# EAGLE design espJhon (EAGLE 9.6.2)
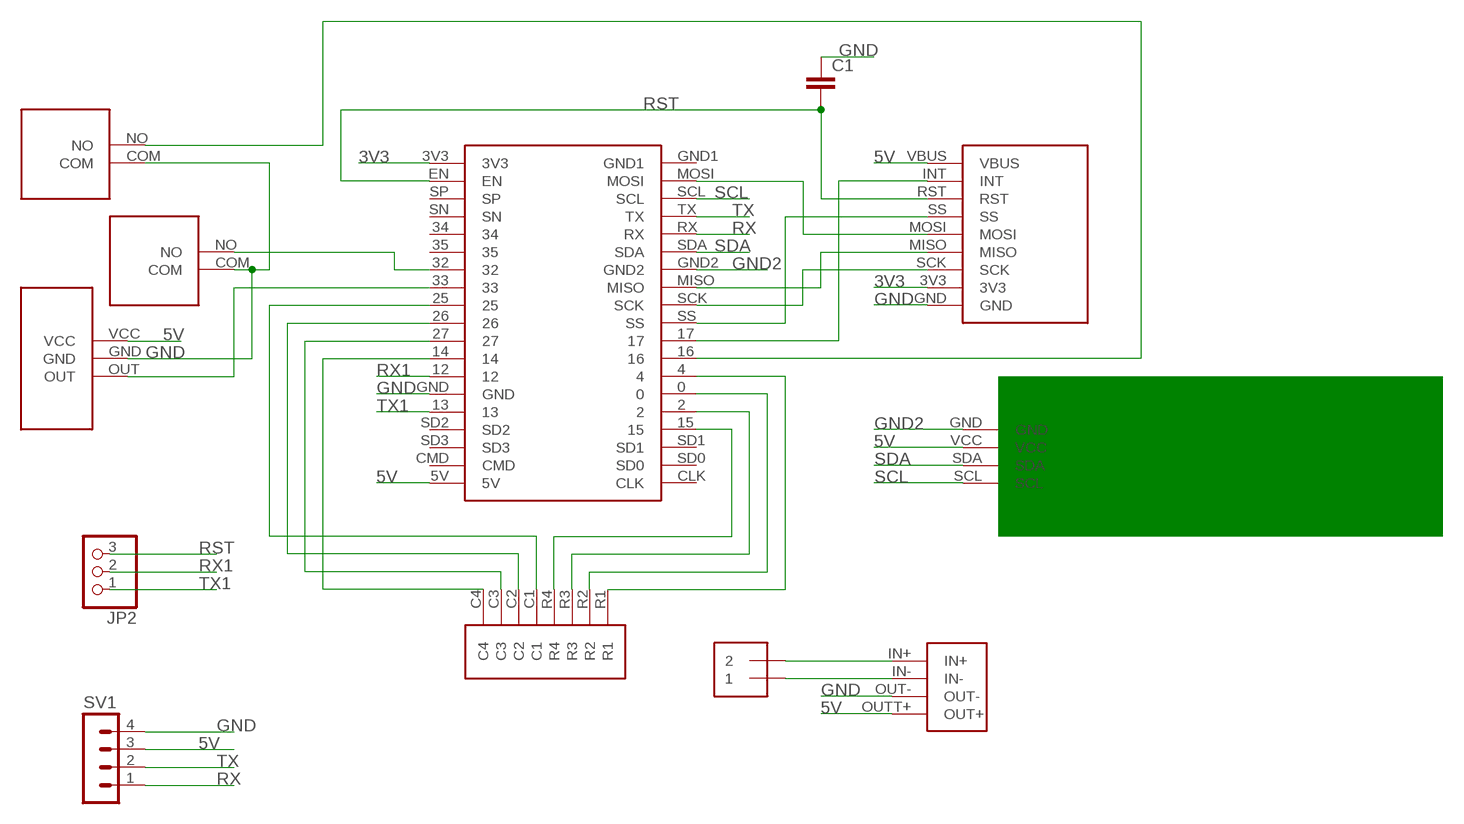
[diagram p0: schematic, sheet 1]

## Parts
C1  C2.5/6  [C2.5-6]
J1  1X2-3.5MM  [1X2-3.5MM]
JP2  PINHD-1X3  [1X03]
SV1  MA04-1  [MA04-1]
U$1  XL4005E1  [XL4005E1]
U$2  USB_HOST  [USB_HOST]
U$3  ESP32_NEW  [ESP32_NEW]
U$4  KEYPAD_4X4  [KEYPAD_4X4]
U$6  LCD_I2C  [LCD_I2C]
U$7  IR_SENSOR  [IR_SENSOR]
U$8  SWITCHLIMITER  [SWICHLIMITER]
U$9  SWITCHLIMITER  [SWICHLIMITER]

## Nets
3V3: U$2.3V3 U$3.3V3
5V: SV1.3 U$1.OUTT+(OUT+) U$2.VBUS U$3.5V U$6.VCC U$7.VCC
GND: C1.1 SV1.4 U$1.OUT- U$2.GND U$3.GND U$7.GND U$8.COM U$9.COM
GND2: U$3.GND2 U$6.GND
N$1: J1.2 U$1.IN+
N$2: J1.1 U$1.IN-
N$3: U$3.14 U$4.C4
N$4: U$3.27 U$4.C3
N$5: U$3.26 U$4.C2
N$6: U$3.25 U$4.C1
N$7: U$3.15 U$4.R4
N$8: U$3.2 U$4.R3
N$9: U$3.0 U$4.R2
N$10: U$3.4 U$4.R1
N$11: U$2.MOSI U$3.MOSI
N$12: U$2.MISO U$3.MISO
N$13: U$2.SCK U$3.SCK
N$14: U$2.SS U$3.SS
N$16: U$2.INT U$3.17
N$20: U$3.33 U$7.OUT
N$21: U$3.32 U$9.NO
N$22: U$3.16 U$8.NO
RST: C1.2 JP2.3 U$2.RST U$3.EN
RX: SV1.1 U$3.RX
RX1: JP2.2 U$3.12
SCL: U$3.SCL U$6.SCL
SDA: U$3.SDA U$6.SDA
TX: SV1.2 U$3.TX
TX1: JP2.1 U$3.13
Unconnected: U$3.34 U$3.35 U$3.CLK U$3.CMD U$3.GND1 U$3.SD0 U$3.SD1 U$3.SD2 U$3.SD3 U$3.SN U$3.SP

## Library data of the parts
C1 = capacitor-wima:C: CAPACITOR naming: grid - package width
J1 = adafruit:1X2: 3.5mm Terminal block http://www.ladyada.net/library/pcb/eaglelibrary.html
JP2 = adafruit:PINHD-1X3: PIN HEADER
SV1 = con-lstb:MA04-1: PIN HEADER; OC_FARNELL: unknown; OC_NEWARK: unknown
U$1 = FusionLocal v17:XL4005E1
U$2 = FusionLocal v17:USB_HOST
U$3 = FusionLocal v17:ESP32_NEW
U$4 = FusionLocal v17:KEYPAD_4X4
U$6 = LocalLib:LCD_I2C
U$7 = LocalLib:IR_SENSOR
U$8 U$9 = LocalLib:SWITCHLIMITER

## Board
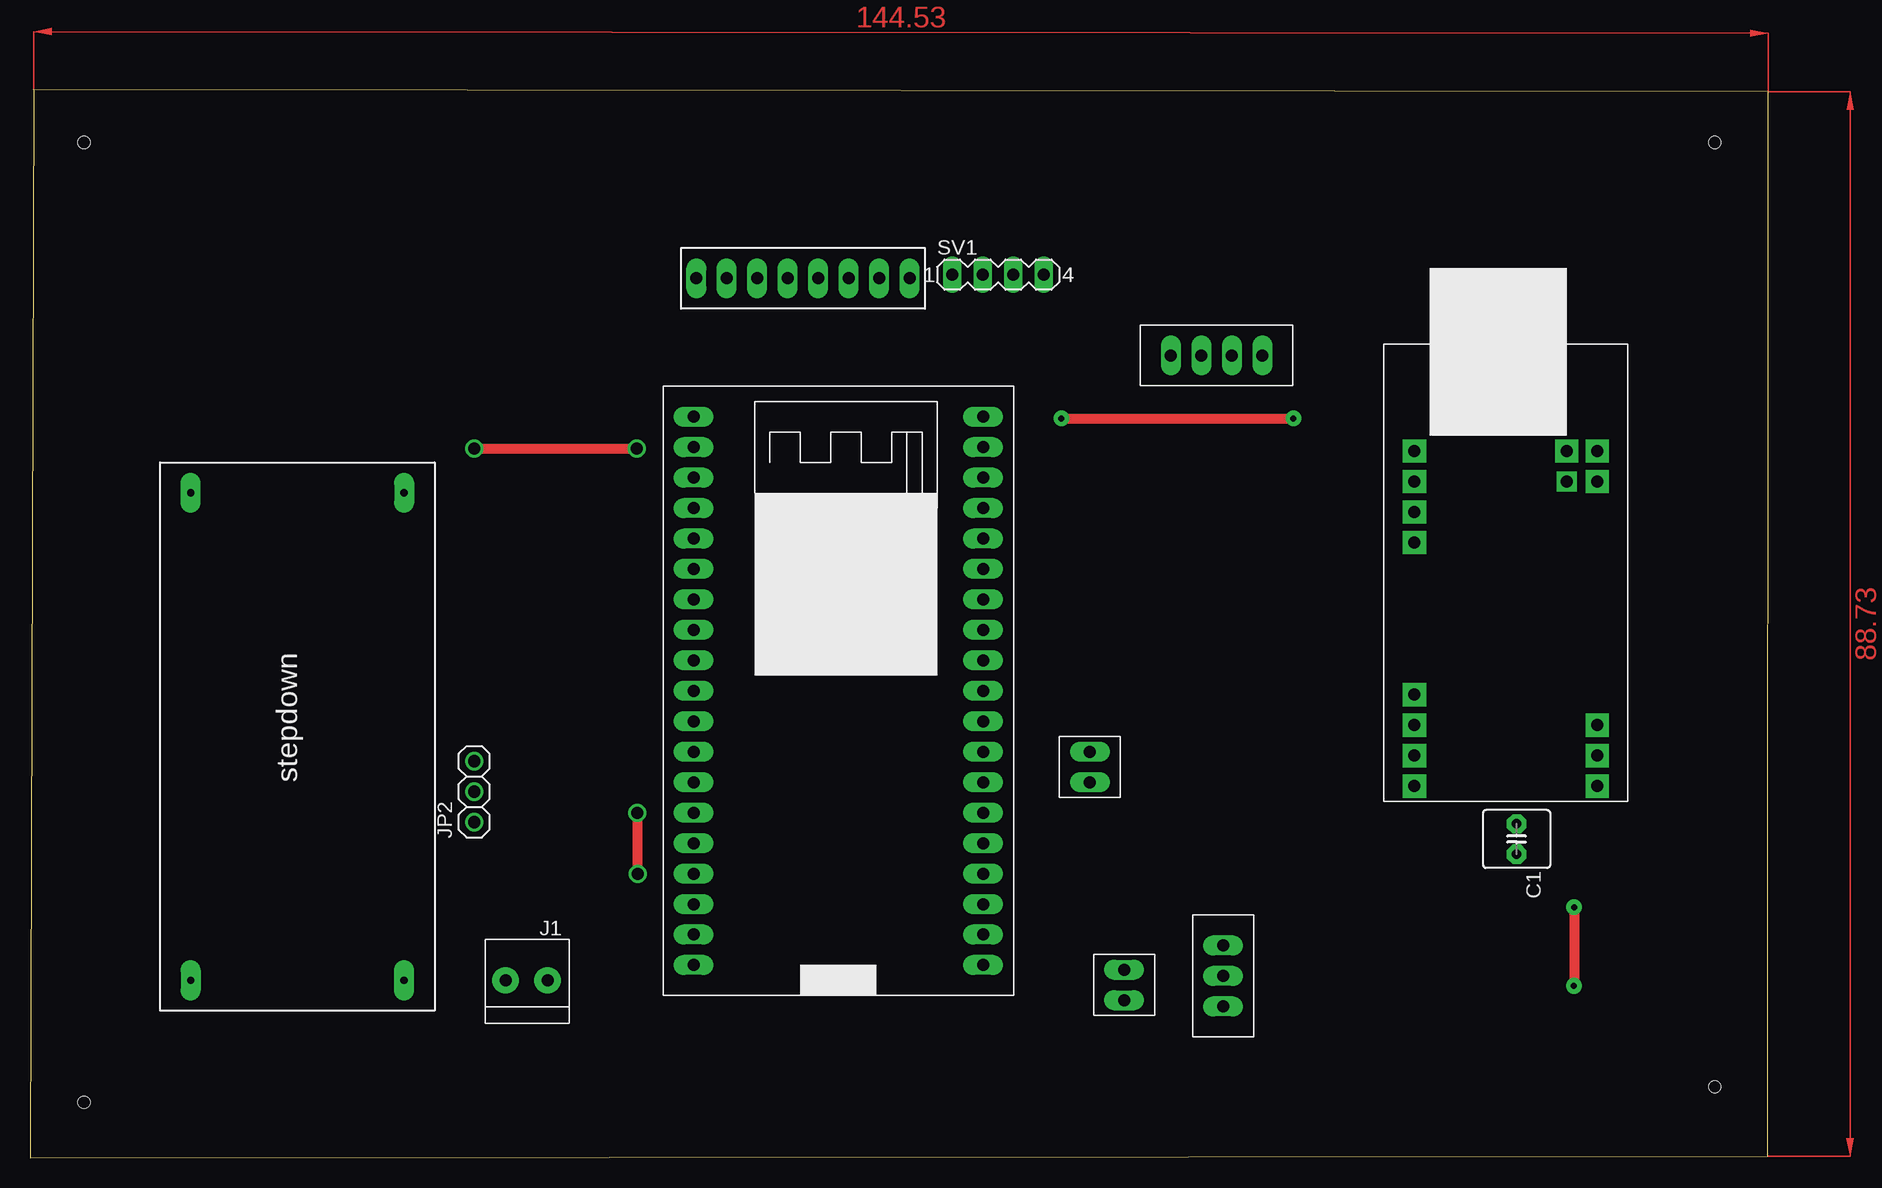
[diagram p1: board, top side]
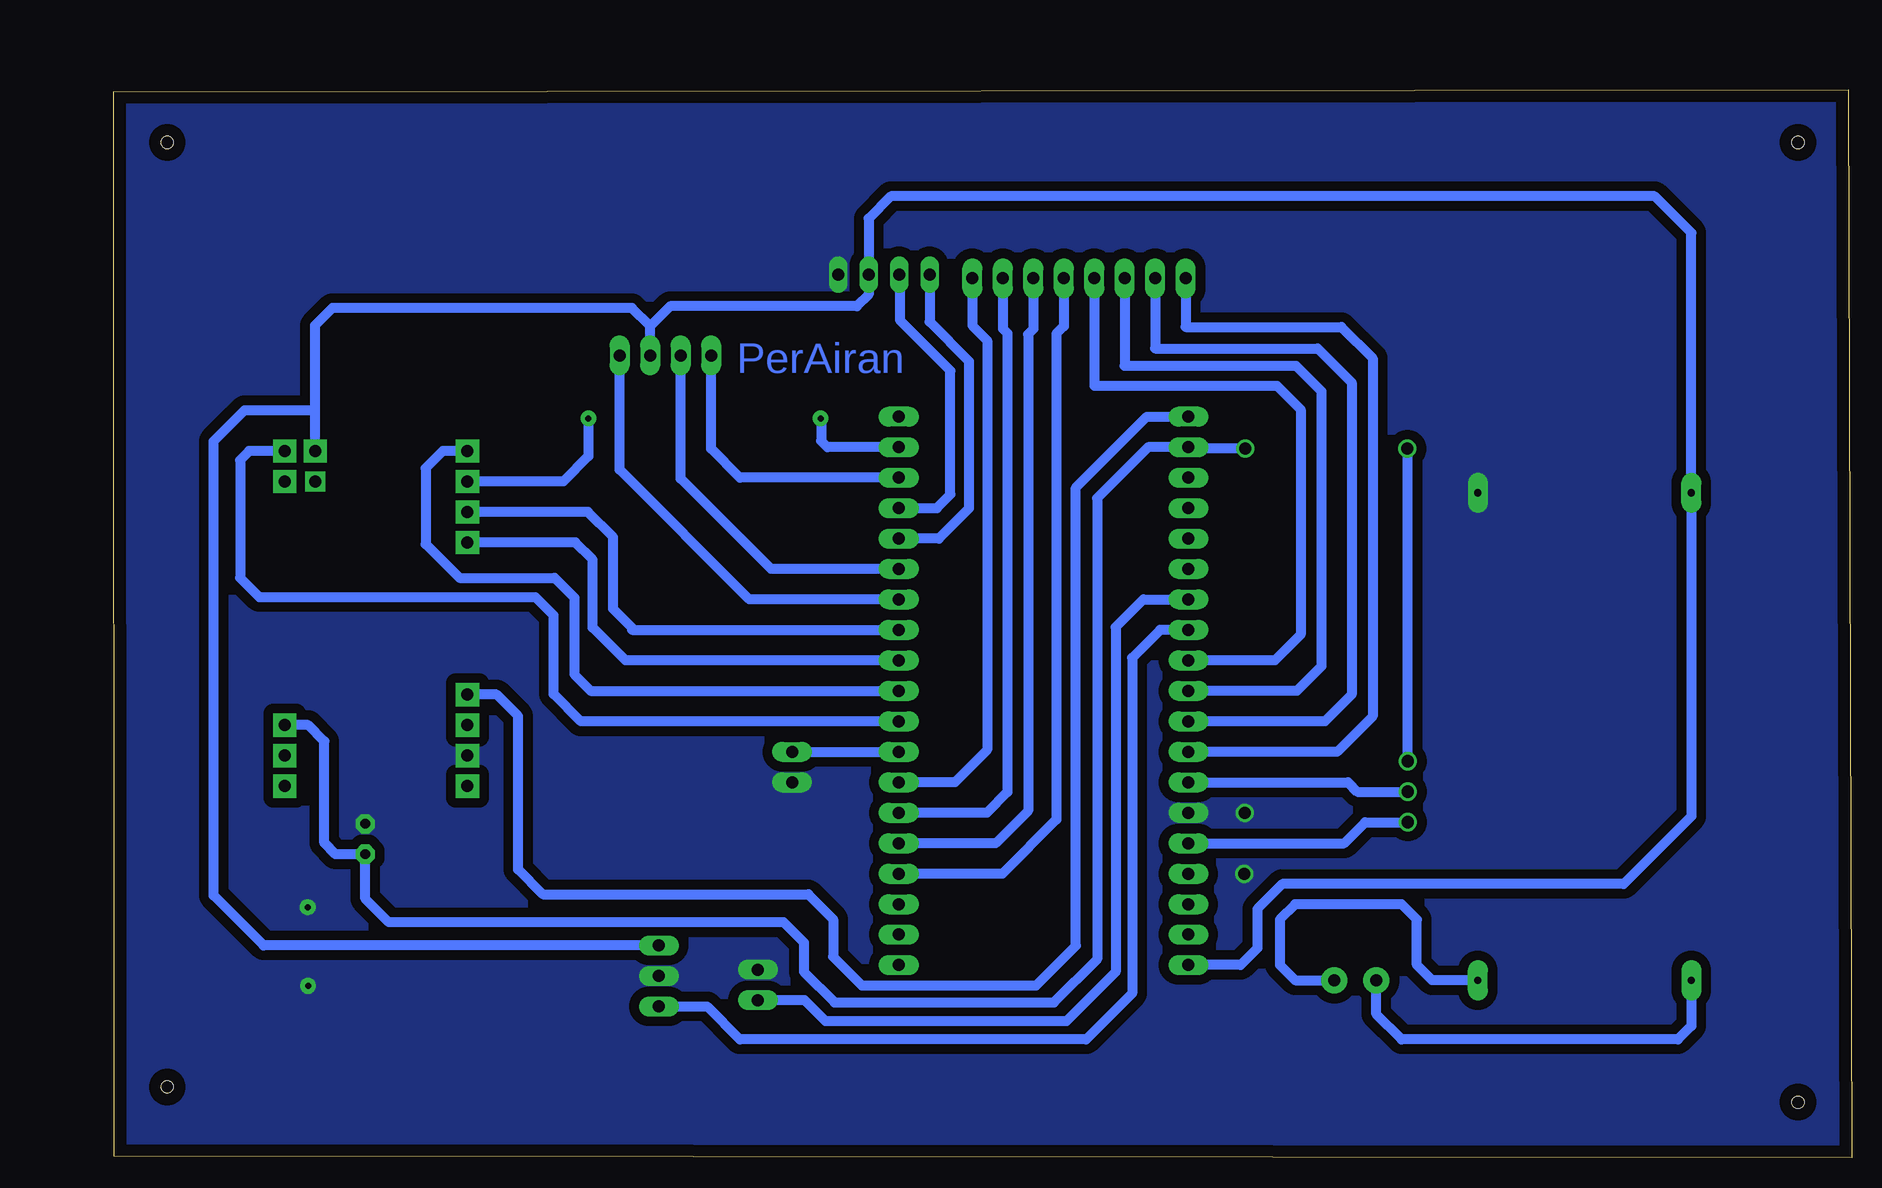
[diagram p2: board, bottom side, seen from below]

Size 144.84 x 89.04 mm. Coordinates in mm from the lower left corner, seen from the top.
Outline: 0,0 144.81,0.15 144.84,88.89 0.31,89.04 0,0
Copper layers (1*16): Top 0.035mm / dielectric 1.5mm / Bottom 0.035mm
Design rules "default": minimum track width 6mil, minimum drill 0.35mm, track to track 6mil, track to pad 6mil, pad to pad 6mil, via to via 6mil, smd to smd 6mil, copper to edge 40mil, drill to drill 6mil, minimum pad ring 10mil, minimum via ring 8mil, stop-mask expansion 4mil, vias tented up to drill 0mil, thermal gap 10mil
Holes 1 mm at 4.5,84.66 4.5,4.64 140.39,5.92 140.39,84.66

### Footprints (pad centres in the part's own frame; a part is rotated, then mirrored left to right if it is on the bottom)
C2.5-6 = drill 0.813 pad 1.6 octagon: 1 -1.27,0; 2 1.27,0
1X2-3.5MM = drill 1 pad 2.184: 1 1.8,0; 2 -1.7,0
1X03 = drill 1.016: 1 -2.54,0; 2 0,0; 3 2.54,0
MA04-1 = drill 1.016 long: 1 -3.81,0; 2 -1.27,0; 3 1.27,0; 4 3.81,0
XL4005E1 = drill 0.6 pad 1.676 long: IN+ 2.54,20.32; IN- 2.54,2.54; OUT- 43.18,2.54; OUTT+ 43.18,20.32
USB_HOST = drill 1 pad 1.93 square: 3V3 29.21,2.54; GND 34.29,2.54; INT 8.89,17.78; MISO 13.97,2.54; MOSI 11.43,2.54; P$9 31.75,2.54; P$11 36.83,2.54; P$19 11.43,17.78; P$28 34.29,17.78; P$29 36.83,17.78; RST 31.75,17.78; SCK 16.51,2.54; SS 8.89,2.54; VBUS 8.89,15.24 | drill 1 pad 1.676 square: P$14 11.43,15.24
ESP32_NEW = drill 1 pad 1.676 long: 0 26.67,15.24; 2 26.67,12.7; 3V3 2.54,48.26; 4 26.67,17.78; 5V 2.54,2.54; 12 2.54,17.78; 13 2.54,12.7; 14 2.54,20.32; 15 26.67,10.16; 16 26.67,20.32; 17 26.67,22.86; 25 2.54,27.94; 26 2.54,25.4; 27 2.54,22.86; 32 2.54,33.02; 33 2.54,30.48; 34 2.54,38.1; 35 2.54,35.56; CLK 26.67,2.54; CMD 2.54,5.08; EN 2.54,45.72; GND 2.54,15.24; GND1 26.67,48.26; GND2 26.67,33.02; MISO 26.67,30.48; MOSI 26.67,45.72; RX 26.67,38.1; SCK 26.67,27.94; SCL 26.67,43.18; SD0 26.67,5.08; SD1 26.67,7.62; SD2 2.54,10.16; SD3 2.54,7.62; SDA 26.67,35.56; SN 2.54,40.64; SP 2.54,43.18; SS 26.67,25.4; TX 26.67,40.64
KEYPAD_4X4 = drill 1 pad 1.676 long: C1 -10.16,3.81; C2 -12.7,3.81; C3 -15.24,3.81; C4 -17.78,3.81; R1 0,3.81; R2 -2.54,3.81; R3 -5.08,3.81; R4 -7.62,3.81
LCD_I2C = drill 1 pad 1.676 long: GND -2.54,10.16; SCL -2.54,2.54; SDA -2.54,5.08; VCC -2.54,7.62
IR_SENSOR = drill 1 pad 1.676 long: GND -5.08,2.54; OUT -7.62,2.54; VCC -2.54,2.54
SWICHLIMITER = drill 1 pad 1.676 long: COM -3.81,2.54; NO -1.27,2.54

### Placement (x,y rotation side)
C1  123.88,26.59 270 top
J1  41.33,14.8 0 top
JP2  37.01,30.53 90 top
SV1  80.67,73.64 0 top
U$1  33.71,12.27 90 top
U$2  112.83,67.83 270 top
U$3  52.76,13.54 0 top
U$4  73.3,69.52 0 top
U$6  92.53,64.36 270 top
U$7  101.96,20.24 90 top
U$8  90.86,35.12 90 top
U$9  88.63,11.88 270 top

### Tracks (layer width: path | path; a pad name or v marks a point on that pad's centre or on a via)
3V3
  Bottom 0.813: U$3.3V3 58.75,61.8 64.68,55.86 64.68,17.69 67.99,14.38 82.51,14.38 84.9,16.77 84.9,19.91 86.97,21.98 109.09,21.98 111.16,24.05 111.16,36.83 112.95,38.62 U$2.3V3
5V
  Bottom 0.813: U$3.5V 50.94,16.07 49.54,17.48 49.54,20.76 47.46,22.84 19.03,22.84 13.39,28.48 U$1.OUTT+ 13.39,77.11 16.45,80.17 80.08,80.17 81.94,78.31 SV1.3 81.94,71.98 82.92,71 98.48,71 100.15,69.33 | U$7.VCC 132.36,17.7 136.54,21.88 136.54,59.74 133.95,62.32 128.08,62.32 | U$6.VCC 100.15,69.33 | 100.15,69.33 101.67,70.84 126.63,70.84 128.08,69.39 128.08,62.32 | 128.08,62.32 U$2.VBUS
GND  (via drill 0.5 pad 1.3, 1 pad 0.95)
  Top 0.813: v128.68,20.9 128.68,14.35 v128.66,14.35 | v50.63,23.7 50.63,28.75 v50.6,28.77
  pour Bottom (isolate 0.813, no thermals): -0.58,88.47 145.47,88.47 145.47,-0.18 -0.58,-0.18
GND2
  Bottom 0.813: U$6.GND 102.69,57.36 91.88,46.55 U$3.GND2
N$1
  Bottom 0.813: U$1.IN+ 13.39,11 14.51,9.88 37.52,9.88 39.63,11.99 J1.2
N$2
  Bottom 0.813: U$1.IN- 34.98,14.8 36.25,16.07 36.25,19.88 37.52,21.16 46.41,21.16 47.68,19.88 47.68,16.07 46.41,14.8 J1.1
N$3
  Bottom 0.813: U$4.C4 55.52,69.28 42.55,69.28 39.95,66.67 39.95,36.81 42.91,33.85 U$3.14
N$4
  Bottom 0.813: U$4.C3 58.06,67.48 44.53,67.48 41.7,64.66 41.7,38.62 43.92,36.4 U$3.27
N$5
  Bottom 0.813: U$4.C2 60.6,66.05 46.33,66.05 44.21,63.92 44.21,40.98 46.26,38.94 U$3.26
N$6
  Bottom 0.813: U$4.C1 63.14,64.38 47.91,64.38 45.94,62.4 45.94,43.62 48.09,41.48 U$3.25
N$7
  Bottom 0.813: U$4.R4 65.68,69.33 66.29,68.72 66.29,28.2 70.8,23.7 U$3.15
N$8
  Bottom 0.813: U$4.R3 68.22,69.09 68.65,68.67 68.65,28.94 71.35,26.23 U$3.2
N$9
  Bottom 0.813: U$4.R2 70.76,69.14 70.37,68.75 70.37,30.49 72.09,28.77 U$3.0
N$10
  Bottom 0.813: U$4.R1 73.3,69.39 72.06,68.16 72.06,34.02 74.76,31.31 U$3.4
N$11  (via drill 0.5 pad 1.3)
  Top 0.813: v85.95,61.66 v105.28,61.66 v105.29,61.64
  Bottom 0.813: U$3.MOSI 85.39,59.25 85.91,59.77 85.91,61.61 v85.95,61.66 | v105.29,61.64 105.29,58.49 107.39,56.39 U$2.MOSI
N$12
  Bottom 0.813: 101.65,44.02 101.49,44.02 | 101.49,44.02 U$3.MISO | 101.49,44.02 103.24,45.77 103.24,51.75 105.34,53.85 U$2.MISO
N$13
  Bottom 0.813: U$3.SCK 102.2,41.48 104.94,44.21 104.94,49.88 106.38,51.31 U$2.SCK
N$14
  Bottom 0.813: U$2.SS 117.42,58.93 118.86,57.49 118.86,51.17 116.03,48.34 108.1,48.34 106.47,46.71 106.47,40.3 105.1,38.94 U$3.SS
N$16
  Bottom 0.813: U$2.INT 133.56,58.93 134.32,58.17 134.32,48.35 132.72,46.75 109.72,46.75 108.2,45.23 108.2,38.66 105.93,36.4 U$3.17
N$20
  Bottom 0.813: U$3.33 57.66,44.02 59.99,41.69 59.99,13.71 63.81,9.88 92.67,9.88 95.41,12.62 U$7.OUT
N$21
  Bottom 0.813: U$3.32 59.05,46.55 61.36,44.24 61.36,15.49 65.46,11.39 85.53,11.39 87.28,13.14 U$9.NO
N$22
  Bottom 0.813: U$8.NO U$3.16
RST  (via drill 1 pad 0.95)
  Top 0.813: v37.04,59.13 v50.55,59.13
  Bottom 0.813: U$2.RST 128.66,36.09 127.3,34.73 127.3,26.24 126.37,25.31 C1.2 123.88,21.61 121.92,19.64 89.02,19.64 87.34,17.96 87.34,15.52 84.78,12.96 66.5,12.96 62.9,16.55 62.9,55 58.65,59.25 U$3.EN 55.17,59.13 v50.55,59.13 | JP2.3 37.01,59.1 v37.04,59.13
RX
  Bottom 0.813: U$3.RX 76.09,51.63 73.58,54.14 73.58,66.42 76.86,69.7 SV1.1
RX1
  Bottom 0.813: U$3.12 41.99,31.31 41.2,30.53 JP2.2
SCL
  Bottom 0.813: U$3.SCL 92.67,56.71 95.07,59.11 U$6.SCL
SDA
  Bottom 0.813: U$3.SDA 90.07,49.09 97.61,56.63 U$6.SDA
TX
  Bottom 0.813: U$3.TX 76.25,54.17 75.12,55.3 75.12,65.62 79.34,69.84 79.34,73.58 SV1.2
TX1
  Bottom 0.813: U$3.13 42.32,26.23 40.57,27.99 JP2.1
(copper drawn outside any net)
  shapes: Top area x2

### Text on the board
Bottom: PerAiran